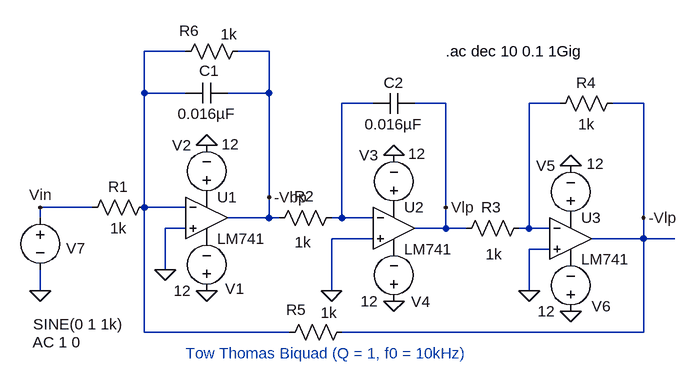
[diagram p0: schematic TowThomasBiquad.asc]
TowThomasBiquad.asc, the LTspice schematic file:
Version 4
SHEET 1 880 680
WIRE 0 -64 -64 -64
WIRE 128 -64 80 -64
WIRE -64 0 -64 -64
WIRE 0 0 -64 0
WIRE 128 0 128 -64
WIRE 128 0 64 0
WIRE 288 16 240 16
WIRE 400 16 352 16
WIRE 576 16 528 16
WIRE 704 16 656 16
WIRE 128 160 128 0
WIRE -144 176 -224 176
WIRE -64 176 -64 0
WIRE 0 176 -64 176
WIRE 400 176 400 16
WIRE -224 192 -224 176
WIRE 128 192 128 160
WIRE 128 192 64 192
WIRE 144 192 128 192
WIRE 240 192 240 16
WIRE 240 192 224 192
WIRE 288 192 240 192
WIRE 704 192 704 16
WIRE 0 208 -32 208
WIRE 400 208 400 176
WIRE 400 208 352 208
WIRE 432 208 400 208
WIRE 528 208 528 16
WIRE 528 208 512 208
WIRE 560 208 528 208
WIRE 288 224 224 224
WIRE 704 224 704 192
WIRE 704 224 624 224
WIRE 752 224 704 224
WIRE 560 240 528 240
WIRE -32 272 -32 208
WIRE -224 304 -224 272
WIRE 224 304 224 224
WIRE 528 304 528 240
WIRE -64 368 -64 176
WIRE 160 368 -64 368
WIRE 704 368 704 224
WIRE 704 368 240 368
FLAG 32 304 0
FLAG 32 80 0
FLAG 320 320 0
FLAG 320 96 0
FLAG 592 112 0
FLAG 592 336 0
FLAG -224 304 0
FLAG 224 304 0
FLAG 528 304 0
FLAG -32 272 0
FLAG -224 176 Vin
FLAG 128 160 -Vbp
FLAG 400 176 Vlp
FLAG 704 192 -Vlp
SYMBOL OpAmps\\LM741 32 128 R0
SYMATTR InstName U1
SYMBOL OpAmps\\LM741 320 144 R0
SYMATTR InstName U2
SYMBOL OpAmps\\LM741 592 160 R0
SYMATTR InstName U3
SYMBOL voltage 32 320 R180
WINDOW 0 -58 19 Left 2
WINDOW 3 24 16 Left 2
SYMATTR InstName V1
SYMATTR Value 12
SYMBOL voltage 32 176 R180
WINDOW 0 24 96 Left 2
WINDOW 3 -50 97 Left 2
SYMATTR InstName V2
SYMATTR Value 12
SYMBOL voltage 320 192 R180
WINDOW 0 24 96 Left 2
WINDOW 3 -49 99 Left 2
SYMATTR InstName V3
SYMATTR Value 12
SYMBOL voltage 320 336 R180
WINDOW 0 -56 15 Left 2
WINDOW 3 24 16 Left 2
SYMATTR InstName V4
SYMATTR Value 12
SYMBOL voltage 592 208 R180
WINDOW 0 24 96 Left 2
WINDOW 3 -52 99 Left 2
SYMATTR InstName V5
SYMATTR Value 12
SYMBOL voltage 592 352 R180
WINDOW 0 -62 24 Left 2
WINDOW 3 24 16 Left 2
SYMATTR InstName V6
SYMATTR Value 12
SYMBOL res -48 160 R90
WINDOW 0 0 56 VBottom 2
WINDOW 3 32 56 VTop 2
SYMATTR InstName R1
SYMATTR Value 1k
SYMBOL res 240 176 R90
WINDOW 0 -2 58 VBottom 2
WINDOW 3 38 60 VTop 2
SYMATTR InstName R2
SYMATTR Value 1k
SYMBOL res 528 192 R90
WINDOW 0 -1 58 VBottom 2
WINDOW 3 40 54 VTop 2
SYMATTR InstName R3
SYMATTR Value 1k
SYMBOL voltage -224 176 R0
WINDOW 0 40 63 Left 2
WINDOW 3 -11 180 Left 2
WINDOW 123 -12 207 Left 2
WINDOW 39 0 0 Left 0
SYMATTR InstName V7
SYMATTR Value SINE(0 1 1k)
SYMATTR Value2 AC 1 0
SYMBOL cap 64 -16 R90
WINDOW 0 -3 28 VBottom 2
WINDOW 3 32 32 VTop 2
SYMATTR InstName C1
SYMATTR Value 0.016µF
SYMBOL cap 352 0 R90
WINDOW 0 0 32 VBottom 2
WINDOW 3 32 32 VTop 2
SYMATTR InstName C2
SYMATTR Value 0.016µF
SYMBOL res 672 0 R90
WINDOW 0 0 56 VBottom 2
WINDOW 3 32 56 VTop 2
SYMATTR InstName R4
SYMATTR Value 1k
SYMBOL res 256 352 R90
WINDOW 0 -3 86 VBottom 2
WINDOW 3 -30 36 VTop 2
SYMATTR InstName R5
SYMATTR Value 1k
SYMBOL res 96 -80 R90
WINDOW 0 0 91 VBottom 2
WINDOW 3 -26 30 VTop 2
SYMATTR InstName R6
SYMATTR Value 1k
TEXT 0 400 Left 2 ;Tow Thomas Biquad (Q = 1, f0 = 10kHz)
TEXT 400 -64 Left 2 !.ac dec 10 0.1 1Gig

The netlist it stands for:
* TowThomasBiquad.asc
XU1 0 N001 P001 P002 -Vbp LM741  ; pins In+ In- V+ V- OUT
XU2 0 N002 P003 P004 Vlp LM741  ; pins In+ In- V+ V- OUT
XU3 0 N003 P005 P006 -Vlp LM741  ; pins In+ In- V+ V- OUT
V1 0 P002 12
V2 P001 0 12
V3 P003 0 12
V4 0 P004 12
V5 P005 0 12
V6 0 P006 12
R1 N001 Vin 1k
R2 N002 -Vbp 1k
R3 N003 Vlp 1k
V7 Vin 0 SINE(0 1 1k) AC 1 0
C1 -Vbp N001 0.016µF
C2 Vlp N002 0.016µF
R4 -Vlp N003 1k
R5 -Vlp N001 1k
R6 -Vbp N001 1k
* Tow Thomas Biquad (Q = 1, f0 = 10kHz)
.ac dec 10 0.1 1Gig
.lib LM741.lib
.backanno
.end